# EAGLE schematic main (EAGLE 9.0.1)
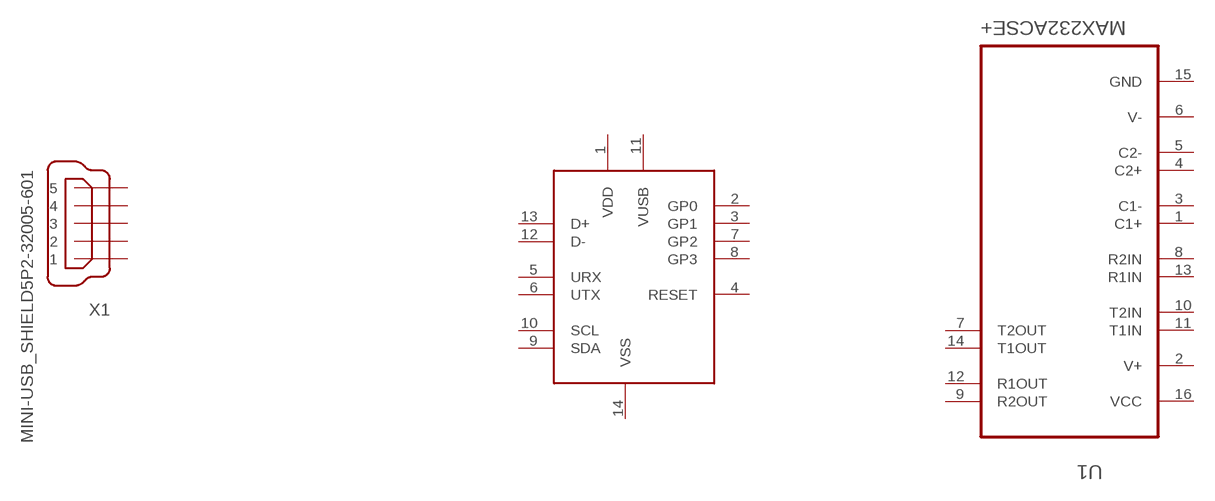
[diagram p0: schematic, sheet 1]

## Parts
BR1  MCP2221A  [DIP14]
U1  MAX232ACSE+  [SOIC127P600X175-16N]
X1  MINI-USB_SHIELD5P2-32005-601  [32005-601]
Unconnected: BR1.1(VDD) BR1.2(GP0) BR1.3(GP1) BR1.4(RESET) BR1.5(URX) BR1.6(UTX) BR1.7(GP2) BR1.8(GP3) BR1.9(SDA) BR1.10(SCL) BR1.11(VUSB) BR1.12(D-) BR1.13(D+) BR1.14(VSS) U1.1(C1+) U1.3(C1-) U1.4(C2+) U1.5(C2-) U1.7(T2OUT) U1.8(R2IN) U1.9(R2OUT) U1.10(T2IN) U1.11(T1IN) U1.12(R1OUT) U1.13(R1IN) U1.14(T1OUT) U1.15(GND) X1.1 X1.2 X1.3 X1.4 X1.5 X1.M1(S1) X1.M2(S2)

## Power pins joined to a net without a drawn wire
V+: U1.2(V+)
V-: U1.6(V-)
VCC: U1.16(VCC)

## Library data of the parts
BR1 = 7_segment_lib:MCP2221A
U1 = Maxim_By_element14_Batch_1:MAX232ACSE+: +5V-Powered, Multichannel RS-232 Drivers/Receivers; MPN: MAX232ACSE+; OC_FARNELL: 9724362; OC_NEWARK: 52K5506; PACKAGE: SOIC-16; SUPPLIER: Maxim
X1 = con-cypressindustries:MINI-USB_SHIELD5P2-: MINI USB-B R/A DIP 5pol. Source: www.cypressindustries.com; OC_FARNELL: unknown; OC_NEWARK: unknown